# Altium schematic sheet RXX-QDSB-SCH11-V1.00.SchDoc
size A3; Date: 20190217; CompanyName: 瑞臻信息（深圳）有限公司; DrawnBy: bob.xu; Address1: 深圳市南山区深南路万利达大厦2201室; Address2: 昆山市花桥镇花桥国际商务城绿地大道231弄9号楼杰座大厦2111室; Address3: 成都市高新区天府二街138号蜀都中心3号楼3110室; Address4: 浙江省宁波市余姚市冶山路475号1401室; Revision: V1.00; SheetOf: 1/1; ProductTitle: 青岛水表; ProductNumber: RXX-QDSB-SCH; : CheckedBy; PageSetup: Record=PageOptions|CenterHorizontal=True|CenterVertical=True|PrintScale=0.73|XCorrection=1.00|YCorrection=1.00|PrintKind=0|BorderSize=5000000|LeftOffset=0|BottomOffset=0|Orientation=2|PaperLength=1000|PaperWidth=1000|Scale=100|PaperSource=7|PrintQuality=-3|MediaType=1|DitherType=10|PrintScaleMode=1|PaperKind=A4|PaperIndex=9
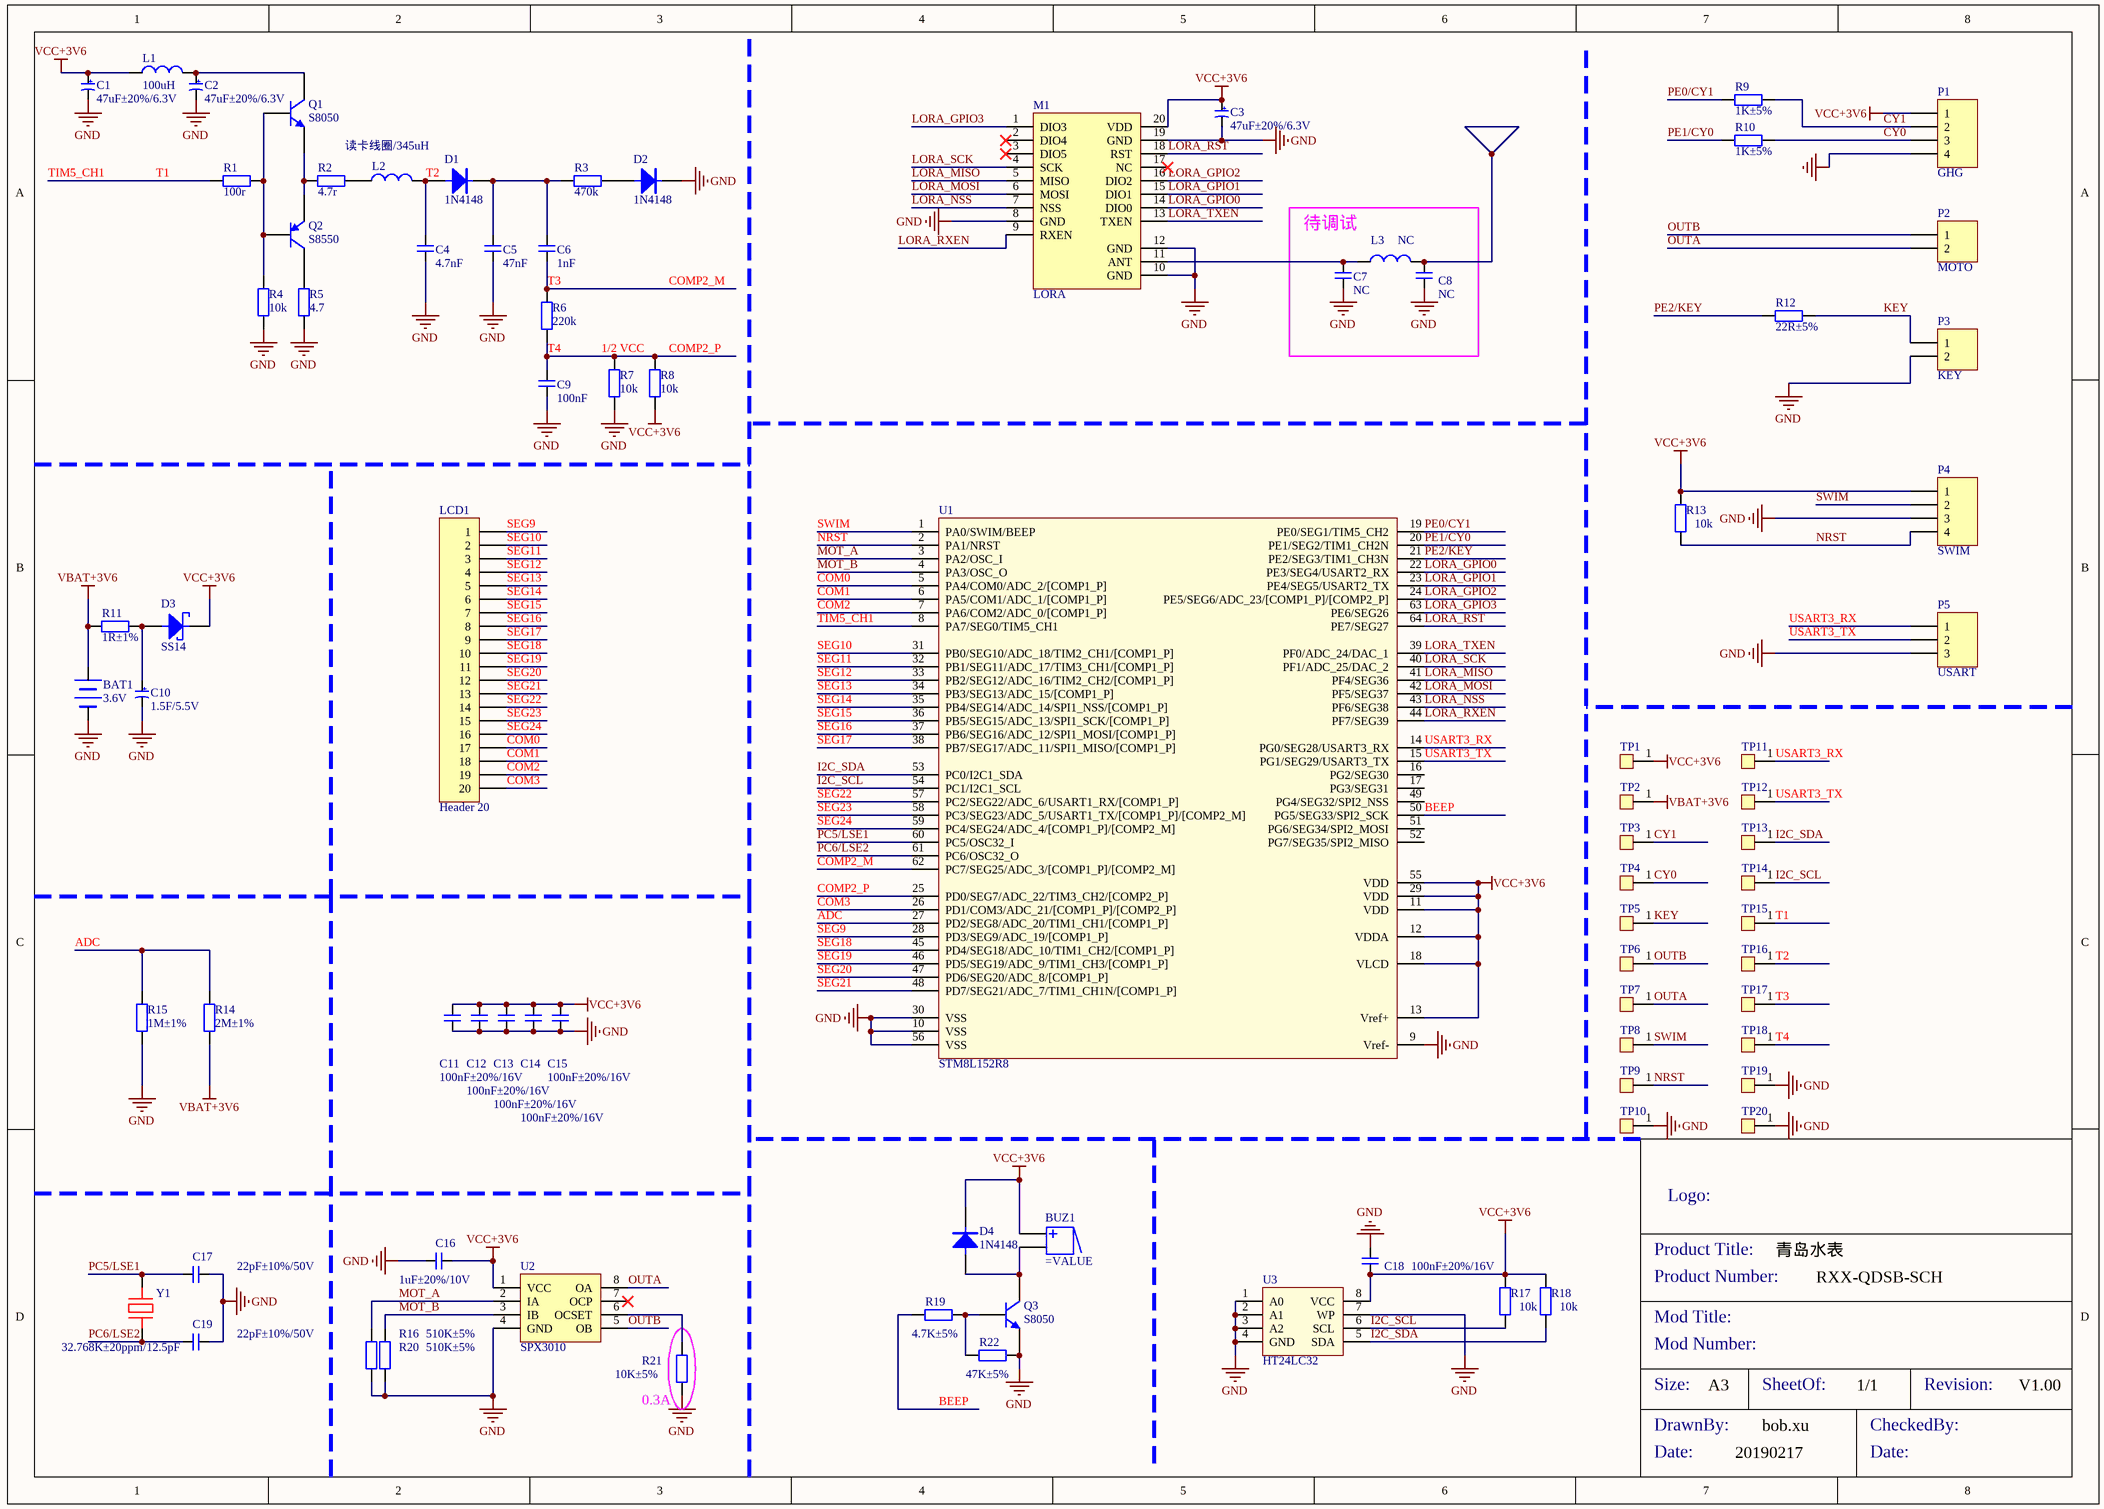
[diagram p0: RXX-QDSB-SCH11-V1.00.SchDoc]

## Parts
BAT1  3.6V  [PH_2P_2R0_5R0X6R0_A]
BUZ1  (no value)  [DIP_BUZZER_2P_6R5_D12H9]
C1  47uF±20%/6.3V  [C3216+]
C2  47uF±20%/6.3V  [C3216+]
C3  47uF±20%/6.3V  [C3216+]
C4  4.7nF
C5  47nF
C6  1nF
C7  NC  [C0402]
C8  NC  [C0402]
C9  100nF
C10  1.5F/5.5V  [CAP_2P_11R0_20X25H10_W]
C11  100nF±20%/16V  [C0402]
C12  100nF±20%/16V  [C0402]
C13  100nF±20%/16V  [C0402]
C14  100nF±20%/16V  [C0402]
C15  100nF±20%/16V  [C0402]
C16  1uF±20%/10V  [C0402]
C17  22pF±10%/50V  [C0402]
C18  100nF±20%/16V  [C0402]
C19  22pF±10%/50V  [C0402]
D1  1N4148
D2  1N4148
D3  SS14  [SMA_2P_2R8X4R6]
D4  1N4148
L1  100uH
L2  读卡线圈/345uH
L3  NC  [L0402]
LCD1  Header 20  [HDR1X20]
M1  LORA  [LORA_PIN_1]
P1  GHG  [PH_4P_2R0_5R0X10R0_A]
P2  MOTO  [PH_2P_2R0_5R0X6R0_A]
P3  KEY  [PH_2P_2R0_5R0X6R0_A]
P4  SWIM  [PH_4P_2R0_5R0X10R0_A]
P5  USART  [PH_3P_2R0_5R0X8R0_A]
Q1  S8050
Q2  S8550
Q3  S8050  [SOT23_3P_0R95_1R3X2R9]
R1  100r
R2  4.7r
R3  470k
R4  10k
R5  4.7
R6  220k
R7  10k
R8  10k
R9  1K±5%  [R0402]
R10  1K±5%  [R0402]
R11  1R±1%  [R0805]
R12  22R±5%  [R0402]
R13  10k  [R0402]
R14  2M±1%  [R0402]
R15  1M±1%  [R0402]
R16  510K±5%  [R0402]
R17  10k  [R0402]
R18  10k  [R0402]
R19  4.7K±5%  [R0402]
R20  510K±5%  [R0402]
R21  10K±5%  [R0402]
R22  47K±5%  [R0402]
TP1  (no value)
TP2  (no value)
TP3  (no value)
TP4  (no value)
TP5  (no value)
TP6  (no value)
TP7  (no value)
TP8  (no value)
TP9  (no value)
TP10  (no value)
TP11  (no value)
TP12  (no value)
TP13  (no value)
TP14  (no value)
TP15  (no value)
TP16  (no value)
TP17  (no value)
TP18  (no value)
TP19  (no value)
TP20  (no value)
U1  STM8L152R8
U2  SPX3010  [SOP_8P_1R27_3R9X4R9]
U3  HT24LC32  [SOP_8P_1R27_3R9X4R9]
Y1  32.768K±20ppm/12.5pF  [SMD_Crystal_2P_1R5X3R2]

## Blocks framed on the sheet
待调试: C7 C8 L3

## Nets
GND: BAT1.2 C1.2 C2.2 C3.2 C4.2 C5.2 C7.2 C8.2 C9.2 C10.2 C11.2 C12.2 C13.2 C14.2 C15.2 C16.2 C17.1 C18.1 C19.1 D2.2(K) M1.8(GND) M1.10(GND) M1.12(GND) M1.19(GND) P1.4 P3.2 P4.3 P5.3 Q3.2(E) R4.1 R5.1 R7.2 R15.1 R16.1 R20.1 R21.1 R22.2 TP10.1 TP19.1 TP20.1 U1.9(Vref-) U1.10(VSS) U1.30(VSS) U1.56(VSS) U2.4(GND) U3.1(A0) U3.2(A1) U3.3(A2) U3.4(GND) U3.7(WP)
VBAT+3V6: BAT1.1 R11.1 R14.2 TP2.1
VCC+3V6: BUZ1.1 C1.1 C3.1 C11.1 C12.1 C13.1 C14.1 C15.1 C16.1 C18.2 D3.2(K) D4.2(K) L1.1 M1.20(VDD) P1.1 P4.1 R8.2 R13.2 R17.2 R18.2 TP1.1 U1.11(VDD) U1.12(VDDA) U1.13(Vref+) U1.18(VLCD) U1.29(VDD) U1.55(VDD) U2.1(VCC) U3.8(VCC)
1/2 VCC: C9.1 R6.2 R7.1 R8.1 TP18.1 U1.25(PD0/SEG7/ADC_22/TIM3_CH2/[COMP2_P])  [also labelled COMP2_P, T4]
ADC: R14.1 R15.2 U1.27(PD2/SEG8/ADC_20/TIM1_CH1/[COMP1_P])
BEEP: R19.2 U1.50(PG5/SEG33/SPI2_SCK)
COM0: LCD1.17 U1.5(PA4/COM0/ADC_2/[COMP1_P])
COM1: LCD1.18 U1.6(PA5/COM1/ADC_1/[COMP1_P])
COM2: LCD1.19 U1.7(PA6/COM2/ADC_0/[COMP1_P])
COM3: LCD1.20 U1.26(PD1/COM3/ADC_21/[COMP1_P]/[COMP2_P])
COMP2_M: C6.2 R6.1 TP17.1 U1.62(PC7/SEG25/ADC_3/[COMP1_P]/[COMP2_M])  [also labelled T3]
CY0: P1.3 R10.1 TP4.1
CY1: P1.2 R9.1 TP3.1
I2C_SCL: R17.1 TP14.1 U1.54(PC1/I2C1_SCL) U3.6(SCL)
I2C_SDA: R18.1 TP13.1 U1.53(PC0/I2C1_SDA) U3.5(SDA)
KEY: P3.1 R12.1 TP5.1
LORA_GPIO0: M1.14(DIO0) U1.22(PE3/SEG4/USART2_RX)
LORA_GPIO1: M1.15(DIO1) U1.23(PE4/SEG5/USART2_TX)
LORA_GPIO2: M1.16(DIO2) U1.24(PE5/SEG6/ADC_23/[COMP1_P]/[COMP2_P])
LORA_GPIO3: M1.1(DIO3) U1.63(PE6/SEG26)
LORA_MISO: M1.5(MISO) U1.41(PF4/SEG36)
LORA_MOSI: M1.6(MOSI) U1.42(PF5/SEG37)
LORA_NSS: M1.7(NSS) U1.43(PF6/SEG38)
LORA_RST: M1.18(RST) U1.64(PE7/SEG27)
LORA_RXEN: M1.9(RXEN) U1.44(PF7/SEG39)
LORA_SCK: M1.4(SCK) U1.40(PF1/ADC_25/DAC_2)
LORA_TXEN: M1.13(TXEN) U1.39(PF0/ADC_24/DAC_1)
MOT_A: R16.2 U1.3(PA2/OSC_I) U2.2(IA)
MOT_B: R20.2 U1.4(PA3/OSC_O) U2.3(IB)
NRST: P4.4 R13.1 TP9.1 U1.2(PA1/NRST)
OUTA: P2.2 TP7.1 U2.8(OA)
OUTB: P2.1 TP6.1 U2.5(OB)
PC5/LSE1: C17.2 U1.60(PC5/OSC32_I) Y1.2
PC6/LSE2: C19.2 U1.61(PC6/OSC32_O) Y1.1
PE0/CY1: R9.2 U1.19(PE0/SEG1/TIM5_CH2)
PE1/CY0: R10.2 U1.20(PE1/SEG2/TIM1_CH2N)
PE2/KEY: R12.2 U1.21(PE2/SEG3/TIM1_CH3N)
SEG9: LCD1.1 U1.28(PD3/SEG9/ADC_19/[COMP1_P])
SEG10: LCD1.2 U1.31(PB0/SEG10/ADC_18/TIM2_CH1/[COMP1_P])
SEG11: LCD1.3 U1.32(PB1/SEG11/ADC_17/TIM3_CH1/[COMP1_P])
SEG12: LCD1.4 U1.33(PB2/SEG12/ADC_16/TIM2_CH2/[COMP1_P])
SEG13: LCD1.5 U1.34(PB3/SEG13/ADC_15/[COMP1_P])
SEG14: LCD1.6 U1.35(PB4/SEG14/ADC_14/SPI1_NSS/[COMP1_P])
SEG15: LCD1.7 U1.36(PB5/SEG15/ADC_13/SPI1_SCK/[COMP1_P])
SEG16: LCD1.8 U1.37(PB6/SEG16/ADC_12/SPI1_MOSI/[COMP1_P])
SEG17: LCD1.9 U1.38(PB7/SEG17/ADC_11/SPI1_MISO/[COMP1_P])
SEG18: LCD1.10 U1.45(PD4/SEG18/ADC_10/TIM1_CH2/[COMP1_P])
SEG19: LCD1.11 U1.46(PD5/SEG19/ADC_9/TIM1_CH3/[COMP1_P])
SEG20: LCD1.12 U1.47(PD6/SEG20/ADC_8/[COMP1_P])
SEG21: LCD1.13 U1.48(PD7/SEG21/ADC_7/TIM1_CH1N/[COMP1_P])
SEG22: LCD1.14 U1.57(PC2/SEG22/ADC_6/USART1_RX/[COMP1_P])
SEG23: LCD1.15 U1.58(PC3/SEG23/ADC_5/USART1_TX/[COMP1_P]/[COMP2_M])
SEG24: LCD1.16 U1.59(PC4/SEG24/ADC_4/[COMP1_P]/[COMP2_M])
SWIM: P4.2 TP8.1 U1.1(PA0/SWIM/BEEP)
T1: R1.2 TP15.1 U1.8(PA7/SEG0/TIM5_CH1)  [also labelled TIM5_CH1]
T2: C4.1 D1.1(A) L2.2 TP16.1
USART3_RX: P5.1 TP11.1 U1.14(PG0/SEG28/USART3_RX)
USART3_TX: P5.2 TP12.1 U1.15(PG1/SEG29/USART3_TX)
NetBUZ1_2: BUZ1.2 D4.1(A) Q3.3(C)
NetC2_1: C2.1 L1.2 Q1.3(C)
NetC5_1: C5.1 C6.1 D1.2(K) R3.2
NetC7_1: C7.1 L3.1 M1.11(ANT)
NetC8_1: C8.1 L3.2
NetC10_1: C10.1 D3.1(A) R11.2
NetD2_1: D2.1(A) R3.1
NetL2_1: L2.1 R2.1
NetQ1_1: Q1.1(B) Q2.1(B) R1.1 R4.2
NetQ1_2: Q1.2(E) Q2.2(E) R2.2
NetQ2_3: Q2.3(C) R5.2
NetQ3_1: Q3.1(B) R19.1 R22.1
NetR21_2: R21.2 U2.6(OCSET)

Not connected (* = marked no-connect by the designer): M1 2(DIO4)* 3(DIO5)* 17(NC)*; U1 16(PG2/SEG30) 17(PG3/SEG31) 49(PG4/SEG32/SPI2_NSS) 51(PG6/SEG34/SPI2_MOSI) 52(PG7/SEG35/SPI2_MISO); U2 7(OCP)*

## Notes on the sheet
- (near R21) 0.3A
- Product Title:
- Logo:
- Product Number:
- Mod Title:
- Size:
- Mod Number:
- A3
- SheetOf:
- Revision:
- DrawnBy:
- Date:
- CheckedBy:

## Library data of the parts
BAT1 = BAT: pin to pad: 1>2 2>1
BUZ1 = 有源蜂鸣器
C1-C3 C10 = 极性电容
C4-C9 C11-C19 = 无极性电容
D1 D2 D4 = 普通二极管
D3 = 肖特基二极管
L1-L3 = 普通电感
LCD1 = Header 20: Header, 20-Pin; LatestRevisionDate: 17-Jul-2002; LatestRevisionNote: Re-released for DXP Platform.; Publisher: Altium Limited
M1 = LORA_PIN_1
P1 P4 = Header 4: Header, 4-Pin; LatestRevisionDate: 17-Jul-2002; LatestRevisionNote: Re-released for DXP Platform.; Publisher: Altium Limited
P2 P3 = Header 2: Header, 2-Pin; LatestRevisionDate: 17-Jul-2002; LatestRevisionNote: Re-released for DXP Platform.; Publisher: Altium Limited
P5 = Header 3: Header, 3-Pin; LatestRevisionDate: 17-Jul-2002; LatestRevisionNote: Re-released for DXP Platform.; Publisher: Altium Limited
Q1 Q3 = NPN三极管
Q2 = PNP三极管
R1-R22 = 普通电阻
TP1-TP20 = Test_Point: 测试点
U3 = 24CXX
Y1 = 两脚晶体谐振器